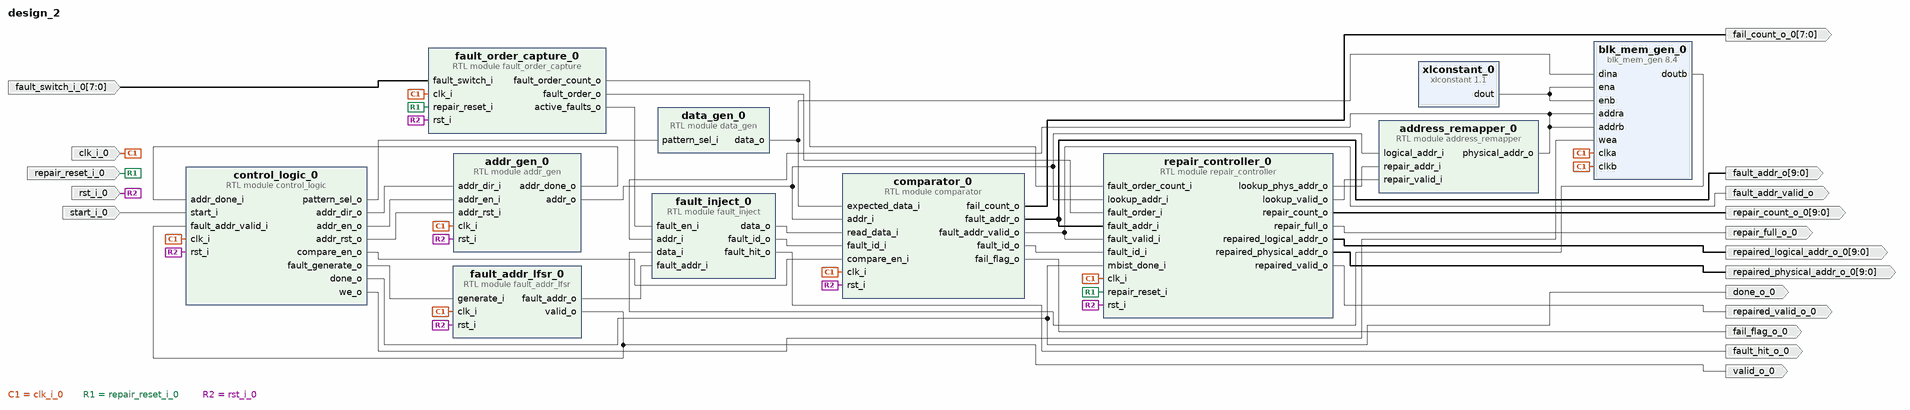
[diagram p0: block diagram of the top level]
# Vivado block design design_2, xc7s50csga324-1, Vivado 2025.2
create_bd_design design_2

create_bd_port -dir I clk_i_0
create_bd_port -dir I rst_i_0
create_bd_port -dir I start_i_0
create_bd_port -dir O done_o_0
create_bd_port -dir O fail_flag_o_0
create_bd_port -dir O -from 7 -to 0 fail_count_o_0
create_bd_port -dir O -from 9 -to 0 repair_count_o_0
create_bd_port -dir O repair_full_o_0
create_bd_port -dir O fault_addr_valid_o
create_bd_port -dir O -from 9 -to 0 fault_addr_o
create_bd_port -dir I repair_reset_i_0
create_bd_port -dir O -from 9 -to 0 repaired_logical_addr_o_0
create_bd_port -dir O -from 9 -to 0 repaired_physical_addr_o_0
create_bd_port -dir O repaired_valid_o_0
create_bd_port -dir O valid_o_0
create_bd_port -dir I -from 7 -to 0 fault_switch_i_0
create_bd_port -dir O fault_hit_o_0

create_bd_cell -type ip -vlnv xilinx.com:ip:blk_mem_gen:8.4 blk_mem_gen_0
set_property -dict [list \
  CONFIG.Assume_Synchronous_Clk true \
  CONFIG.Disable_Collision_Warnings true \
  CONFIG.Memory_Type Simple_Dual_Port_RAM \
  CONFIG.Operating_Mode_A NO_CHANGE \
  CONFIG.Write_Depth_A 1024 \
  CONFIG.Write_Width_A 32 \
  CONFIG.use_bram_block Stand_Alone \
] [get_bd_cells blk_mem_gen_0]
create_bd_cell -type module -reference addr_gen addr_gen_0
create_bd_cell -type module -reference comparator comparator_0
create_bd_cell -type module -reference data_gen data_gen_0
create_bd_cell -type module -reference control_logic control_logic_0
create_bd_cell -type ip -vlnv xilinx.com:ip:xlconstant:1.1 xlconstant_0
create_bd_cell -type module -reference fault_inject fault_inject_0
create_bd_cell -type module -reference repair_controller repair_controller_0
create_bd_cell -type module -reference address_remapper address_remapper_0
create_bd_cell -type module -reference fault_addr_lfsr fault_addr_lfsr_0
create_bd_cell -type module -reference fault_order_capture fault_order_capture_0

# ---- connections ----

connect_bd_net [get_bd_pins addr_gen_0/addr_done_o] [get_bd_pins control_logic_0/addr_done_i]
connect_bd_net [get_bd_pins addr_gen_0/addr_o] \
  [get_bd_pins repair_controller_0/lookup_addr_i] [get_bd_pins comparator_0/addr_i] \
  [get_bd_pins address_remapper_0/logical_addr_i]
connect_bd_net [get_bd_pins address_remapper_0/physical_addr_o] \
  [get_bd_pins blk_mem_gen_0/addrb] [get_bd_pins blk_mem_gen_0/addra] [get_bd_pins fault_inject_0/addr_i]
connect_bd_net [get_bd_pins blk_mem_gen_0/doutb] [get_bd_pins fault_inject_0/data_i]
connect_bd_net -net clk_i_0_1 [get_bd_ports clk_i_0] \
  [get_bd_pins blk_mem_gen_0/clka] [get_bd_pins blk_mem_gen_0/clkb] [get_bd_pins fault_order_capture_0/clk_i] \
  [get_bd_pins control_logic_0/clk_i] [get_bd_pins repair_controller_0/clk_i] [get_bd_pins comparator_0/clk_i] \
  [get_bd_pins addr_gen_0/clk_i] [get_bd_pins fault_addr_lfsr_0/clk_i]
connect_bd_net [get_bd_pins comparator_0/fail_count_o] [get_bd_ports fail_count_o_0]
connect_bd_net [get_bd_pins comparator_0/fail_flag_o] [get_bd_ports fail_flag_o_0]
connect_bd_net [get_bd_pins comparator_0/fault_addr_o] [get_bd_ports fault_addr_o] [get_bd_pins repair_controller_0/fault_addr_i]
connect_bd_net [get_bd_pins comparator_0/fault_addr_valid_o] [get_bd_ports fault_addr_valid_o] [get_bd_pins repair_controller_0/fault_valid_i]
connect_bd_net [get_bd_pins comparator_0/fault_id_o] [get_bd_pins repair_controller_0/fault_id_i]
connect_bd_net [get_bd_pins control_logic_0/addr_dir_o] [get_bd_pins addr_gen_0/addr_dir_i]
connect_bd_net [get_bd_pins control_logic_0/addr_en_o] [get_bd_pins addr_gen_0/addr_en_i]
connect_bd_net [get_bd_pins control_logic_0/addr_rst_o] [get_bd_pins addr_gen_0/addr_rst_i]
connect_bd_net [get_bd_pins control_logic_0/compare_en_o] [get_bd_pins comparator_0/compare_en_i]
connect_bd_net [get_bd_pins control_logic_0/done_o] [get_bd_ports done_o_0] [get_bd_pins repair_controller_0/mbist_done_i]
connect_bd_net [get_bd_pins control_logic_0/fault_generate_o] [get_bd_pins fault_addr_lfsr_0/generate_i]
connect_bd_net [get_bd_pins control_logic_0/pattern_sel_o] [get_bd_pins data_gen_0/pattern_sel_i]
connect_bd_net [get_bd_pins control_logic_0/we_o] [get_bd_pins blk_mem_gen_0/wea]
connect_bd_net [get_bd_pins data_gen_0/data_o] [get_bd_pins blk_mem_gen_0/dina] [get_bd_pins comparator_0/expected_data_i]
connect_bd_net [get_bd_pins fault_addr_lfsr_0/fault_addr_o] [get_bd_pins fault_inject_0/fault_addr_i]
connect_bd_net [get_bd_pins fault_addr_lfsr_0/valid_o] [get_bd_ports valid_o_0] [get_bd_pins control_logic_0/fault_addr_valid_i]
connect_bd_net [get_bd_pins fault_inject_0/data_o] [get_bd_pins comparator_0/read_data_i]
connect_bd_net [get_bd_pins fault_inject_0/fault_hit_o] [get_bd_ports fault_hit_o_0]
connect_bd_net [get_bd_pins fault_inject_0/fault_id_o] [get_bd_pins comparator_0/fault_id_i]
connect_bd_net [get_bd_pins fault_order_capture_0/active_faults_o] [get_bd_pins fault_inject_0/fault_en_i]
connect_bd_net [get_bd_pins fault_order_capture_0/fault_order_count_o] [get_bd_pins repair_controller_0/fault_order_count_i]
connect_bd_net [get_bd_pins fault_order_capture_0/fault_order_o] [get_bd_pins repair_controller_0/fault_order_i]
connect_bd_net -net fault_switch_i_0_1 [get_bd_ports fault_switch_i_0] [get_bd_pins fault_order_capture_0/fault_switch_i]
connect_bd_net [get_bd_pins repair_controller_0/lookup_phys_addr_o] [get_bd_pins address_remapper_0/repair_addr_i]
connect_bd_net [get_bd_pins repair_controller_0/lookup_valid_o] [get_bd_pins address_remapper_0/repair_valid_i]
connect_bd_net [get_bd_pins repair_controller_0/repair_count_o] [get_bd_ports repair_count_o_0]
connect_bd_net [get_bd_pins repair_controller_0/repair_full_o] [get_bd_ports repair_full_o_0]
connect_bd_net [get_bd_pins repair_controller_0/repaired_logical_addr_o] [get_bd_ports repaired_logical_addr_o_0]
connect_bd_net [get_bd_pins repair_controller_0/repaired_physical_addr_o] [get_bd_ports repaired_physical_addr_o_0]
connect_bd_net [get_bd_pins repair_controller_0/repaired_valid_o] [get_bd_ports repaired_valid_o_0]
connect_bd_net -net repair_reset_i_0_1 [get_bd_ports repair_reset_i_0] \
  [get_bd_pins fault_order_capture_0/repair_reset_i] [get_bd_pins repair_controller_0/repair_reset_i]
connect_bd_net -net rst_i_0_1 [get_bd_ports rst_i_0] \
  [get_bd_pins fault_order_capture_0/rst_i] [get_bd_pins control_logic_0/rst_i] [get_bd_pins repair_controller_0/rst_i] \
  [get_bd_pins comparator_0/rst_i] [get_bd_pins addr_gen_0/rst_i] [get_bd_pins fault_addr_lfsr_0/rst_i]
connect_bd_net -net start_i_0_1 [get_bd_ports start_i_0] [get_bd_pins control_logic_0/start_i]
connect_bd_net [get_bd_pins xlconstant_0/dout] [get_bd_pins blk_mem_gen_0/ena] [get_bd_pins blk_mem_gen_0/enb]

validate_bd_design
save_bd_design
